# Altium schematic sheet P02-DC_JACK.SchDoc
size 594 x 420 mm
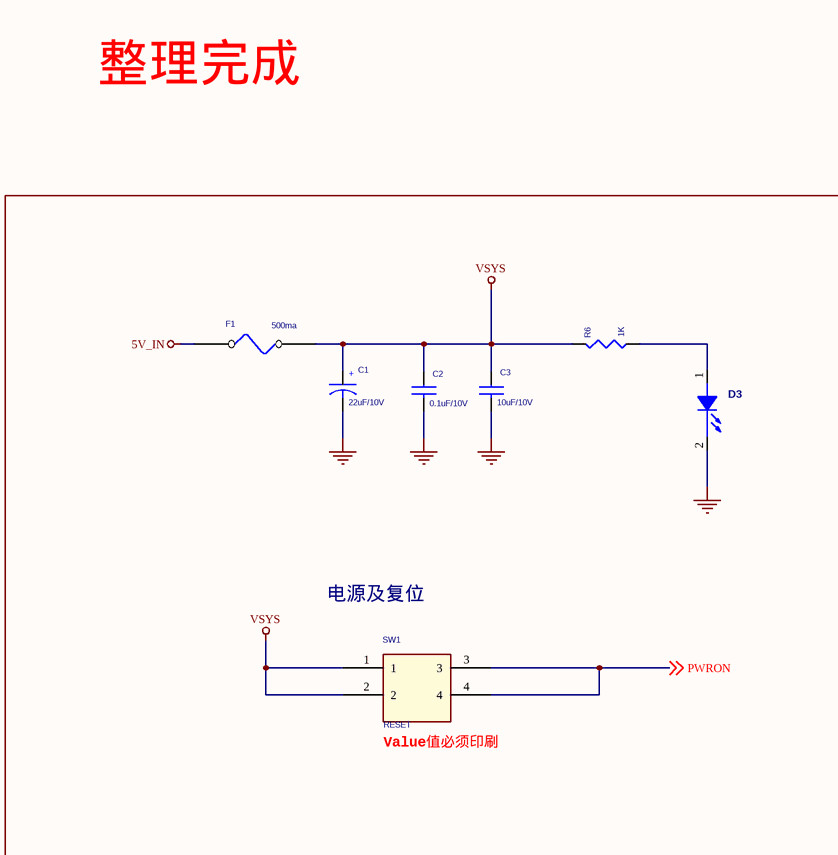
[diagram p0: P02-DC_JACK.SchDoc, top left]
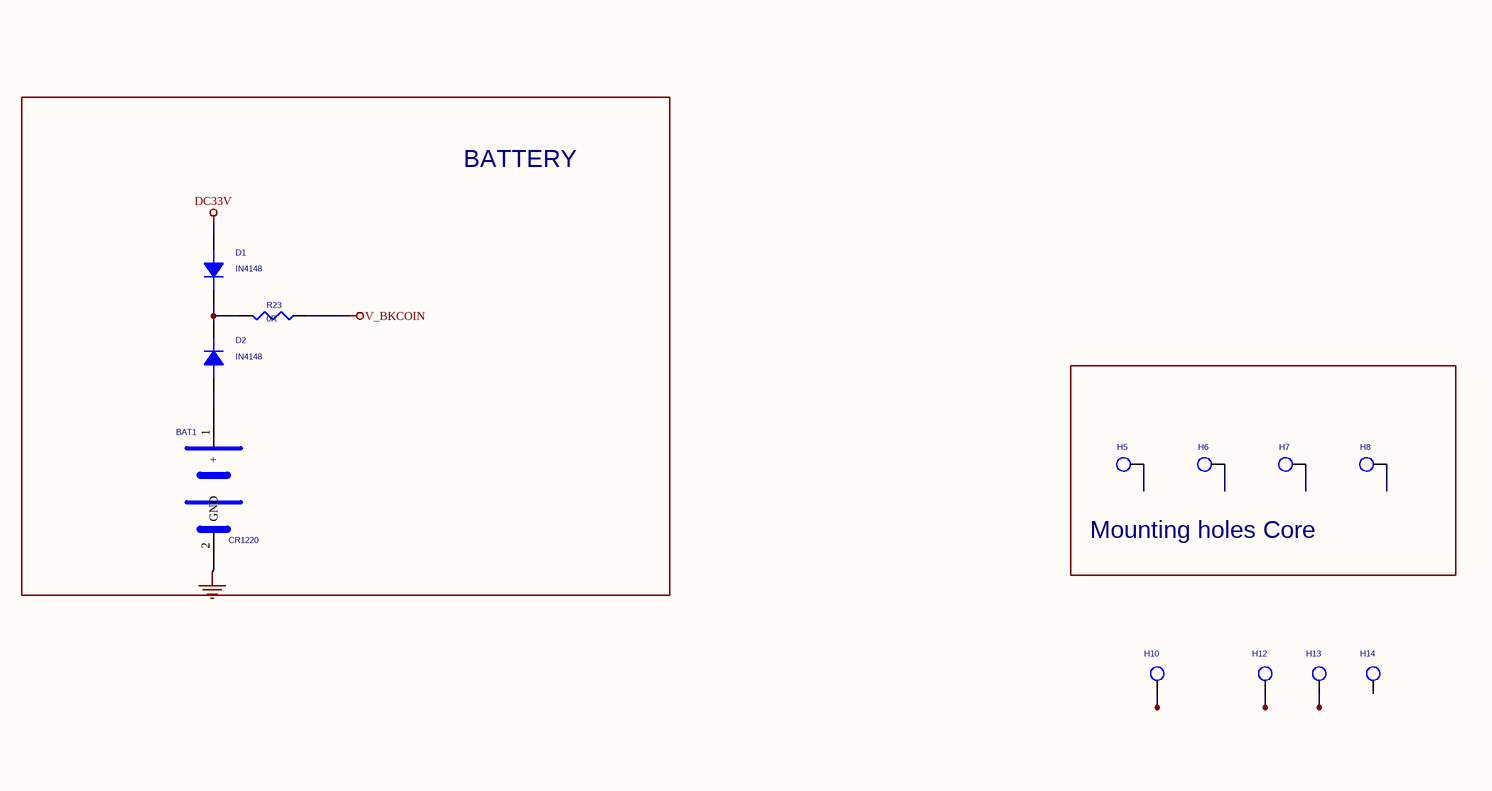
[diagram p1: P02-DC_JACK.SchDoc, top right]
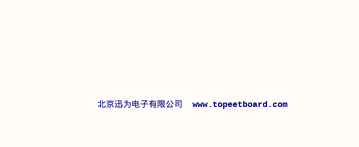
[diagram p2: P02-DC_JACK.SchDoc, bottom right]

## Parts
BAT1  CR1220  [BAT1]
C1  22uF/10V  [C1206-S]
C2  0.1uF/10V  [C0603-S]
C3  10uF/10V  [C0603-S]
D1  IN4148  [D1206]
D2  IN4148  [D1206]
D3  LED-Red (SMD 2012)  [LED0603]  (value not drawn)
F1  500ma  [F1812]
H5  TP_P0_0.8_D0  [HOLE2_7]  (value not drawn)
H6  TP_P0_0.8_D0  [hole2_7]  (value not drawn)
H7  TP_P0_0.8_D0  [hole2_7]  (value not drawn)
H8  TP_P0_0.8_D0  [hole2_7]  (value not drawn)
H10  TP_P0_0.8_D0  [HOLE2_7]  (value not drawn)
H12  TP_P0_0.8_D0  [HOLE2_7]  (value not drawn)
H13  TP_P0_0.8_D0  [HOLE2_7]  (value not drawn)
H14  TP_P0_0.8_D0  [HOLE2_7]  (value not drawn)
R6  1K  [R0603-S]
R23  0R  [R0603-S]
SW1  RESET  [SW4-SMD]

## Blocks framed on the sheet
电源及复位: C1-C3 D3 F1 R6 SW1
BATTERY: BAT1 D1 D2 R23
Mounting holes Core: H5-H8

## Nets
5V_IN: F1.1
DC33V: D1.1(A)
GND: BAT1.2(GND) C1.2 C2.2 C3.2 D3.2(CATHODE)
V_BKCOIN: R23.1
VSYS: C1.1 C2.1 C3.1 F1.2 R6.2 SW1.1 SW1.2
PWRON: SW1.3 SW1.4 ; off-sheet PWRON
NetBAT1_1: BAT1.1(+) D2.1(A)
NetD1_2: D1.2(K) D2.2(K) R23.2
NetD3_1: D3.1(ANODE) R6.1

Not connected (* = marked no-connect by the designer): H5 1; H6 1; H7 1; H8 1; H10 1; H12 1; H13 1; H14 1

## Notes on the sheet
- 整理完成
- (near SW1) Value值必须印刷
- 北京迅为电子有限公司  www.topeetboard.com
- (in symbol CT2012_0) +

## Library data of the parts
BAT1 = BATTERY_0
C1 = CT2012_0
C2 C3 = C1608_Dup1
D1 D2 = DIODE
D3 = LED-RED_SMD_1
F1 = FUSE
R6 = R1005_0_Dup1
R23 = R
SW1 = SW-4